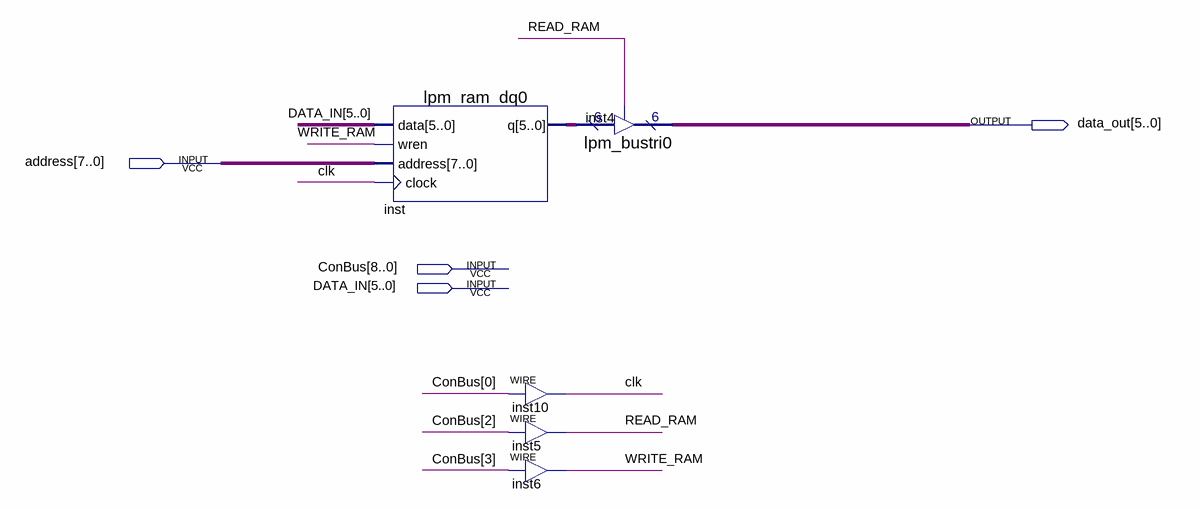
[diagram p0: schematic sheet]
// Quartus schematic ram.bdf as structural Verilog: 5 symbols, 4 pins
module ram (
  input  [7:0] address,
  input  [8:0] ConBus,
  input  [5:0] DATA_IN,
  output [5:0] data_out
);

  wire clk, READ_RAM, WRITE_RAM;
  wire [5:0] inst_q;

  lpm_ram_dq0 inst (.data(DATA_IN), .wren(WRITE_RAM), .address(address), .clock(clk), .q(inst_q));
  assign clk = ConBus[0];  // WIRE inst10
  assign READ_RAM = ConBus[2];  // WIRE inst5
  assign WRITE_RAM = ConBus[3];  // WIRE inst6
  lpm_bustri0 inst4 (.enabledt(READ_RAM), .data(inst_q), .tridata(data_out));
endmodule
